# EAGLE schematic untitled (EAGLE 6.3)
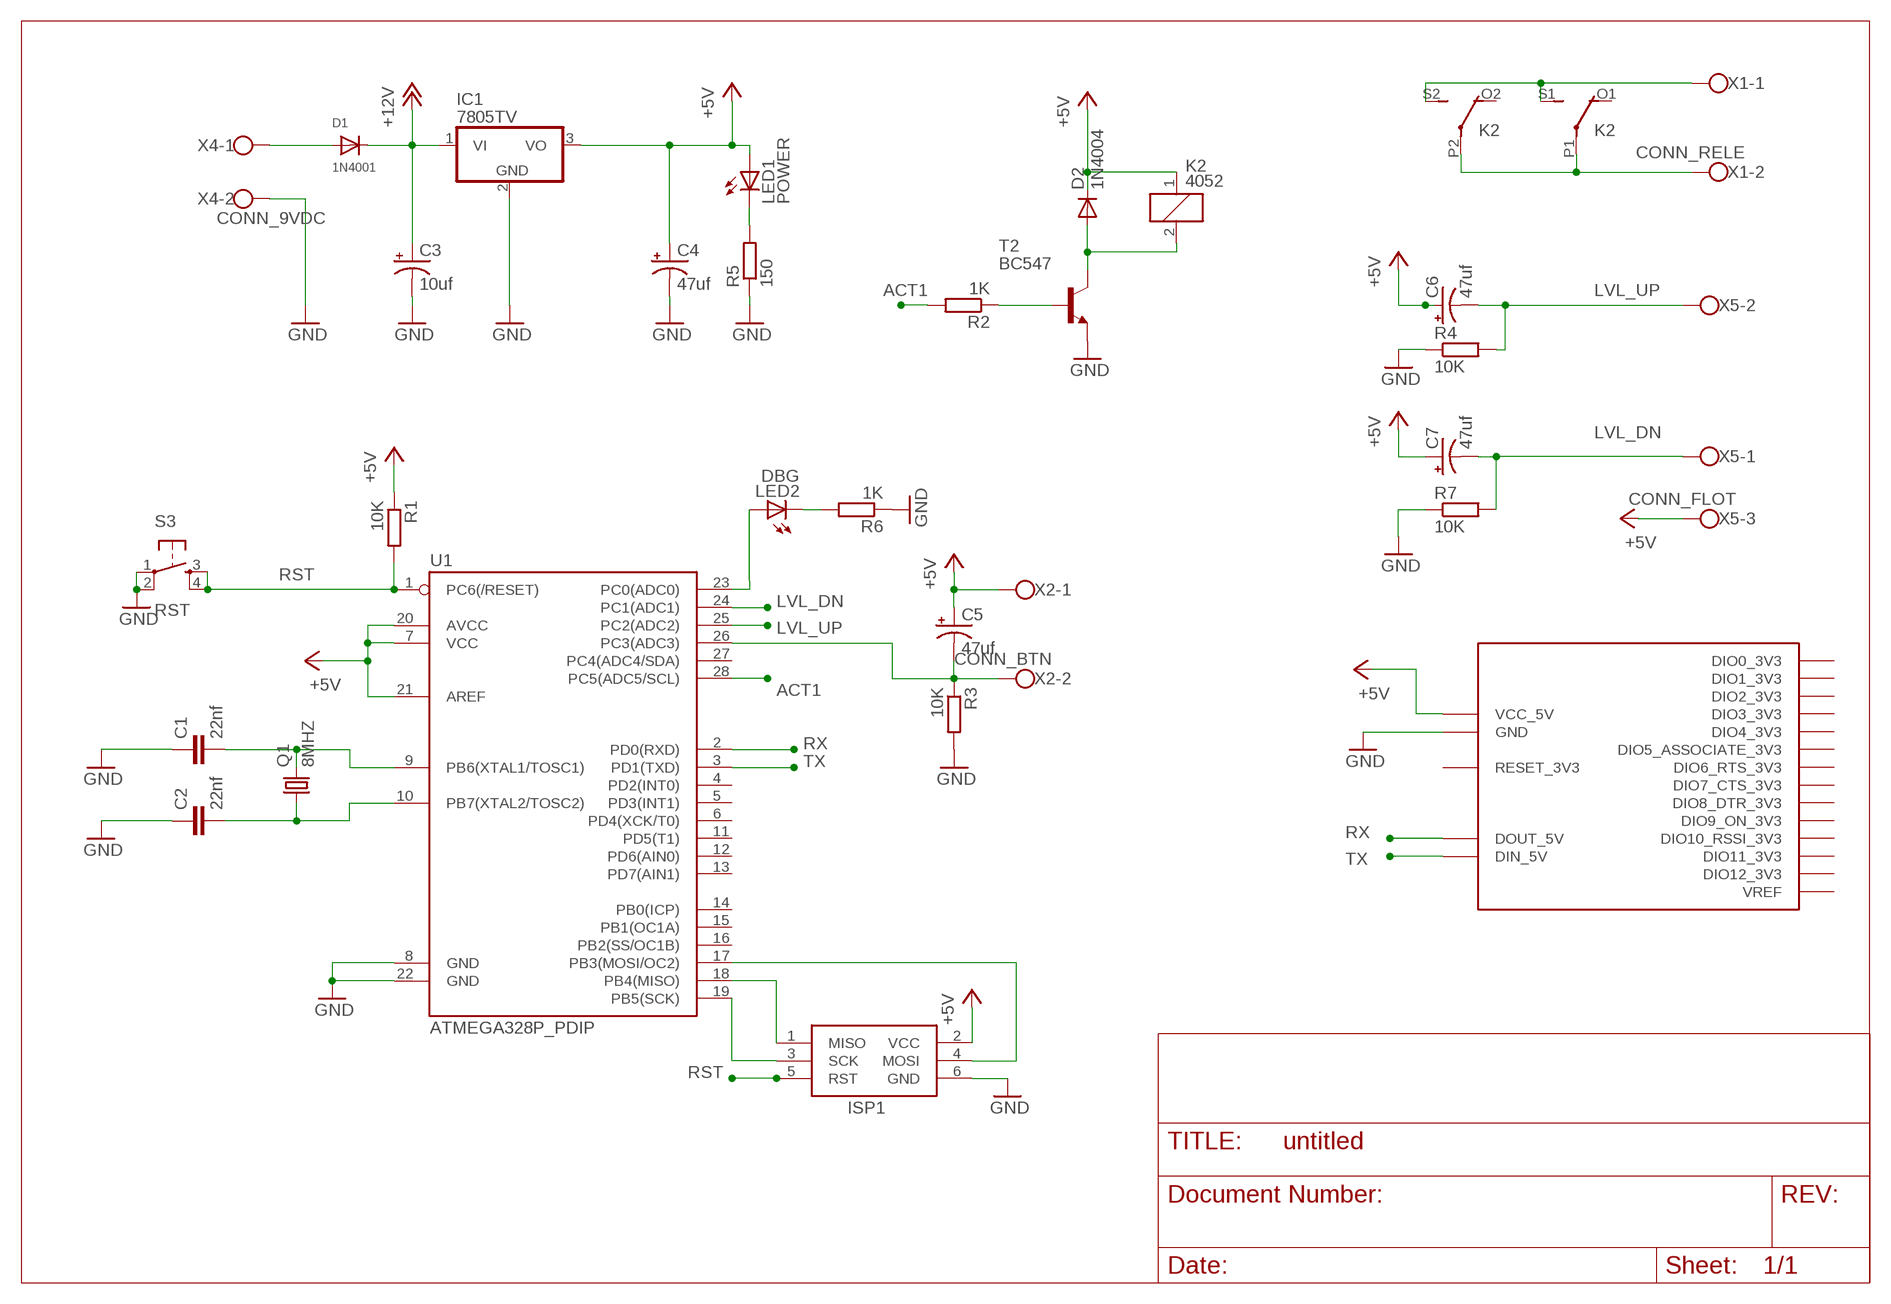
[diagram p0: schematic, sheet 1]

## Parts
C1  22nf  C2,5-3  [C2.5-3]
C2  22nf  C2,5-3  [C2.5-3]
C3  10uf  CPOL-USE2.5-6  [E2,5-6]
C4  47uf  CPOL-USE2.5-6  [E2,5-6]
C5  47uf  CPOL-USE2.5-6  [E2,5-6]
C6  47uf  CPOL-USE2.5-6  [E2,5-6]
C7  47uf  CPOL-USE2.5-6  [E2,5-6]
D1  1N4001  DIODEDO-1N4148  [DO-1N4148]
D2  1N4004  [DO41-10]
IC1  7805TV  [TO220V]
ISP1  AVRISP-6  [AVRISP]
K2  4052  [F4052]
LED1  POWER  LED5MM  [LED5MM]
LED2  DBG  LED5MM  [LED5MM]
Q1  8MHZ  CRYSTALHC49U70  [HC49U70]
R1  10K  R-EU_0207/10  [0207/10]
R2  1K  R-EU_0207/10  [0207/10]
R3  10K  R-EU_0207/10  [0207/10]
R4  10K  R-EU_0207/10  [0207/10]
R5  150  R-EU_0207/10  [0207/10]
R6  1K  R-EU_0207/10  [0207/10]
R7  10K  R-EU_0207/10  [0207/10]
S3  RST  TAC_SWITCHPTH  [TACTILE-PTH]
T2  BC547  BC547-NPN-TO92-CBE  [TO92-CBE]
U1  ATMEGA328P_PDIP  [DIL28-3]
U$1  XBEE_BREAKOUT_DIGOLE  [PDIP]
X1  CONN_RELE  W237-102  [W237-102]
X2  CONN_BTN  W237-102  [W237-102]
X4  CONN_9VDC  W237-102  [W237-102]
X5  CONN_FLOT  W237-103  [W237-103]

## Nets
+5V: C4.+ C5.+ C6.+ C7.+ D2.C IC1.3(VO) ISP1.2(VCC) K2.1 LED1.A R1.1 U1.7(VCC) U1.20(AVCC) U1.21(AREF) U$1.VCC_5V X2.1 X5.3
+12V [POWER12]: C3.+ D1.C IC1.1(VI)
ACT1: R2.2 U1.28(PC5(ADC5/SCL))
BTN_ONOFF: C5.- R3.1 U1.26(PC3(ADC3)) X2.2
GND: C1.1 C2.1 C3.- C4.- IC1.2(GND) ISP1.6(GND) R3.2 R4.1 R5.1 R6.1 R7.1 S3.1 S3.2 T2.E U1.8(GND) U1.22(GND) U$1.GND X4.2
LVL_DN: C7.- R7.2 U1.24(PC1(ADC1)) X5.1
LVL_UP: C6.- R4.2 U1.25(PC2(ADC2)) X5.2
N$1: ISP1.4(MOSI) U1.17(PB3(MOSI/OC2))
N$2: ISP1.1(MISO) U1.18(PB4(MISO))
N$3: C2.2 Q1.1 U1.10(PB7(XTAL2/TOSC2))
N$4: D2.A K2.2 T2.C
N$5: C1.2 Q1.2 U1.9(PB6(XTAL1/TOSC1))
N$6: R2.1 T2.B
N$7: K2.P1(2:P) K2.P2(3:P) X1.2
N$8: K2.S1(2:S) K2.S2(3:S) X1.1
N$9: ISP1.3(SCK) U1.19(PB5(SCK))
N$10: LED1.K(C) R5.2
N$11 [POWER12]: D1.A X4.1
N$17: LED2.K(C) R6.2
N$18: LED2.A U1.23(PC0(ADC0))
RST: ISP1.5(RST) R1.2 S3.3 S3.4 U1.1(PC6(/RESET))
RX: U1.2(PD0(RXD)) U$1.DOUT(DOUT_5V)
TX: U1.3(PD1(TXD)) U$1.DIN_5V
Unconnected: K2.O1(2:O) K2.O2(3:O) U1.4(PD2(INT0)) U1.5(PD3(INT1)) U1.6(PD4(XCK/T0)) U1.11(PD5(T1)) U1.12(PD6(AIN0)) U1.13(PD7(AIN1)) U1.14(PB0(ICP)) U1.15(PB1(OC1A)) U1.16(PB2(SS/OC1B)) U1.27(PC4(ADC4/SDA)) U$1.ASSOCIATE_3V3(DIO5_ASSOCIATE_3V3) U$1.CTS_3V3(DIO7_CTS_3V3) U$1.DIO0_3V3 U$1.DIO1_3V3 U$1.DIO2_3V3 U$1.DIO3_3V3 U$1.DIO4_3V3 U$1.DIO11_3V3 U$1.DIO12_3V3 U$1.DTR_3V3(DIO8_DTR_3V3) U$1.ON_3V3(DIO9_ON_3V3) U$1.RESET_3V3 U$1.RSSI_3V3(DIO10_RSSI_3V3) U$1.RTS_3V3(DIO6_RTS_3V3) U$1.VREF_3V3(VREF)

## Library data of the parts
C1 C2 = capacitor-wima:C: CAPACITOR naming: grid - package width
C3-C7 = adafruit:CPOL-US: POLARIZED CAPACITOR, American symbol
D1 = adafruit:DIODE: Diode SMADIODE - SMA Surface Mount Package 20V 1A Schottky Diode Digikey: 641-1014-6-ND DO-1N4148 - Through Hole Small Current Diode SOD-123 20V 1 A (.5mV Vf) Schottky Diode - Digikey: MBRX120TPMSCT-ND SOD-323 10V 570mA (.38mV Vf, 3ns) Schottky Diode - Digikey: ZLLS410CT-ND SOD-523 30V 30mA Schottky Diode (RB751S-40TE61) - Digikey: RB751S-40TE61CT-ND SOT23-R/W - SOT23 Package (R = Solder Paste/Reflow Ovens, W = Hand-Soldering) BAT54Film 40V 300mA - Digikey: 497-7162-1-ND
D2 = adafruit:1N4004: DIODE General purpose 1N400x type rectifier (With bigger pads) http://www.ladyada.net/library/pcb/eaglelibrary.html
IC1 = linear:78*: Positive VOLTAGE REGULATOR Source: http://cache.national.com/ds/LM/LM78L05.pdf http://www.fairchildsemi.com/ds/LM/LM7805.pdf
ISP1 = adafruit:AVRISP: AVR ISP HEADER Standard 6 pin header for AVR programming
K2 = relay:4052: RELAY 2 x switch, Finder; OC_FARNELL: unknown; OC_NEWARK: unknown
LED1 LED2 = adafruit:LED: LED OSRAM: - CHIPLED LG R971, LG N971, LY N971, LG Q971, LY Q971, LO R971, LY R971 LH N974, LH R974 LS Q976, LO Q976, LY Q976 LO Q996 - Hyper CHIPLED LW Q18S LB Q993, LB Q99A, LB R99A - SideLED LS A670, LO A670, LY A670, LG A670, LP A670 LB A673, LV A673, LT A673, LW A673 LH A674 LY A675 LS A676, LA A676, LO A676, LY A676, LW A676 LS A679, LY A679, LG A679 - Hyper Micro SIDELED® LS Y876, LA Y876, LO Y876, LY Y876 LT Y87S - SmartLED LW L88C, LW L88S LB L89C, LB L89S, LG L890 LS L89K, LO L89K, LY L89K LS L896, LA L896, LO L896, LY L896 - TOPLED LS T670, LO T670, LY T670, LG T670, LP T670 LSG T670, LSP T670, LSY T670, LOP T670, LYG T670 LG T671, LOG T671, LSG T671 LB T673, LV T673, LT T673, LW T673 LH T674 LS T676, LA T676, LO T676, LY T676, LB T676, LH T676, LSB T676, LW T676 LB T67C, LV T67C, LT T67C, LS T67K, LO T67K, LY T67K, LW E67C LS E67B, LA E67B, LO E67B, LY E67B, LB E67C, LV E67C, LT E67C LW T67C LS T679, LY T679, LG T679 LS T770, LO T770, LY T770, LG T770, LP T770 LB T773, LV T773, LT T773, LW T773 LH T774 LS E675, LA E675, LY E675, LS T675 LS T776, LA T776, LO T776, LY T776, LB T776 LHGB T686 LT T68C, LB T68C - Hyper Mini TOPLED® LB M676 - Mini TOPLED Santana® LG M470 LS M47K, LO M47K, LY M47K Source: http://www.osram.convergy.de/
Q1 = crystal:CRYSTAL: CRYSTAL; OC_FARNELL: unknown; OC_NEWARK: unknown
R1-R7 = resistor:R-EU_: RESISTOR, European symbol
S3 = SparkFun-Electromechanical:TAC_SWITCH: Momentary Switch Button commonly used for reset or general input. Spark Fun Electronics SKU : COM-00097 SMT- SWCH-08247
T2 = transistor:*-NPN-: NPN Transistror BF959 corrected 2008.03.06
U1 = SparkFun-DigitalIC:ATMEGA328P_PDIP: uC used in the Arduino 32kb flash, 1k EEPROM, 2k SRAM This is the through-hole version of this chip.
U$1 = Soler:XBEE_BREAKOUT_DIGOLE
X1 X2 X4 = con-wago-500:W237-102: WAGO SCREW CLAMP; MPN: 237-102; OC_FARNELL: unknown; OC_NEWARK: 70K9898
X5 = con-wago-500:W237-103: WAGO SCREW CLAMP; MPN: 237-103; OC_FARNELL: unknown; OC_NEWARK: 18M7116

## Net classes
1 MAINS: width 0.762 mm, clearance 1.27 mm
2 POWER12: width 0.406 mm, clearance 0.508 mm